# EAGLE design weaver_groveph (EAGLE 7.4.0)
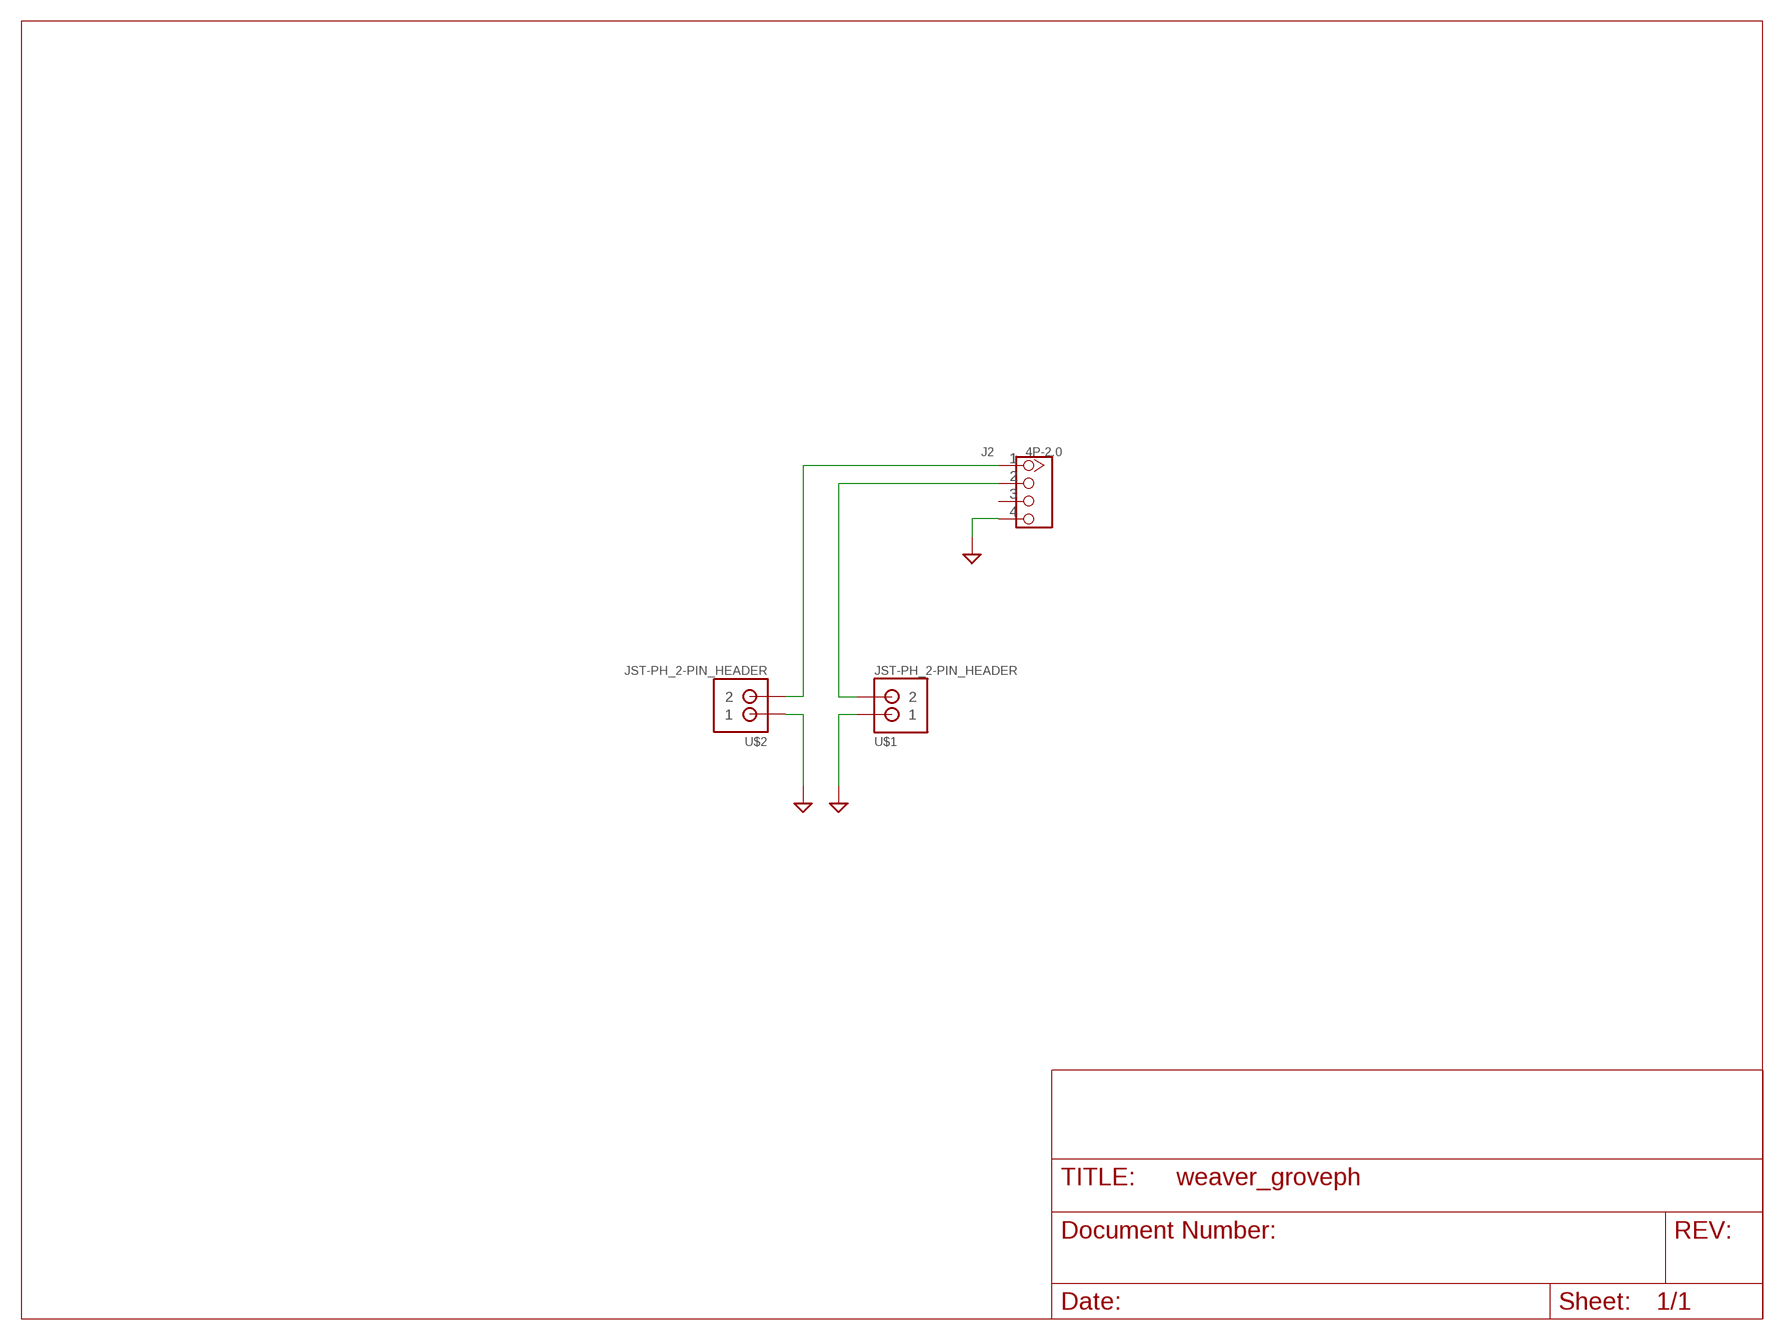
[diagram p0: schematic, sheet 1]

## Parts
J2  4P-2.0  GROVE-CONNECTOR-DIP(4P-2.0)  [HW4-2.0]
U$1  JST-PH_2-PIN_HEADER  [JST_B2B-PH_HEADER]
U$2  JST-PH_2-PIN_HEADER  [JST_B2B-PH_HEADER]

## Nets
GND: J2.4 U$1.P1 U$2.P1
N$3: J2.1 U$2.P2
N$4: J2.2 U$1.P2
Unconnected: J2.3

## Library data of the parts
J2 = NanoPlaygroundFace:GROVE-CONNECTOR-DIP(4P-2.0): 320110033
U$1 U$2 = SRG:JST-PH_2-PIN_HEADER: 2-pin JST PH Shrouded Header, top entry P/N B2B-PH-K-S Mating connector PHR-2 Mating cable assembly: Sparkfun PRT-09914 <http://www.sparkfun.com/products/9914>

## Net classes
0 default: width 0.305 mm, drill 0.508 mm, clearance 0.254 mm

## Board
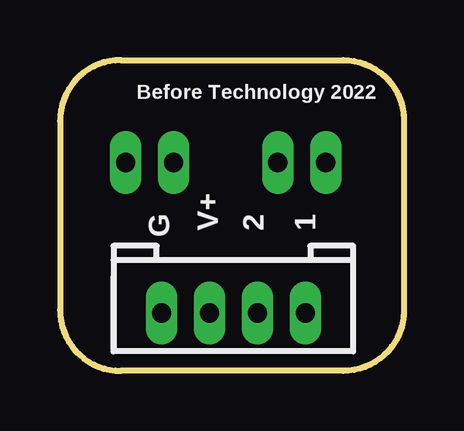
[diagram p1: board, top side]
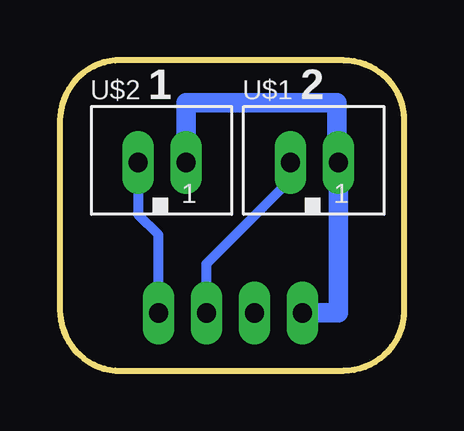
[diagram p2: board, bottom side, seen from below]

Size 14.35 x 12.95 mm. Coordinates in mm from the lower left corner, seen from the top.
Outline: 0,10.41 0,2.54 arc90 2.54,0 11.81,0 arc90 14.35,2.54 14.35,10.41 arc90 11.81,12.95 2.54,12.95 arc90 0,10.41
Copper layers (1*16): Top 0.035mm / dielectric 1.5mm / Bottom 0.035mm
Design rules "default *": minimum track width 10mil, minimum drill 20mil, track to track 8mil, track to pad 8mil, pad to pad 8mil, via to via 8mil, smd to smd 8mil, copper to edge 40mil, drill to drill 8mil, minimum pad ring 10mil, minimum via ring 8mil, stop-mask expansion 4mil, vias tented up to drill 0mil, thermal gap 10mil

### Footprints (pad centres in the part's own frame; a part is rotated, then mirrored left to right if it is on the bottom)
HW4-2.0 = drill 0.8 pad 1.27 long: 1 -3,0; 2 -1,0; 3 1,0; 4 3,0
JST_B2B-PH_HEADER = drill 0.8 long: P1 1.075,0.048; P2 -0.925,0.048

### Placement (x,y rotation side)
J2  7.24,2.41 180 top
U$1  3.81,8.64 0 bottom
U$2  10.16,8.64 0 bottom

### Tracks (layer width: path | path; a pad name or v marks a point on that pad's centre or on a via)
GND
  Bottom 0.813: J2.4 2.73,2.41 U$1.P1 2.79,8.68 2.79,11.18 9.09,11.18 U$2.P1
N$3
  Bottom 0.406: U$2.P2 11.09,6.51 10.24,5.67 J2.1
N$4
  Bottom 0.406: J2.2 8.24,4.46 4.74,7.96 U$1.P2

### Text on the board
tPlace: Before Technology 2022 | G | V+ | 2 | 1
bPlace: 2 | 1